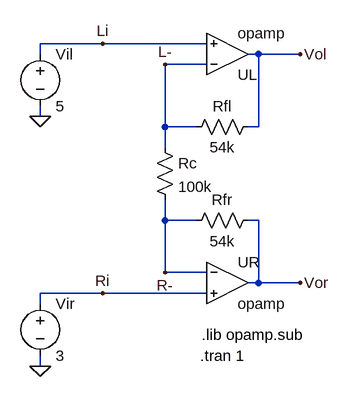
[diagram p0: schematic TDA8425_spatial.asc]
TDA8425_spatial.asc, the LTspice schematic file:
Version 4
SHEET 1 880 680
WIRE 0 0 -96 0
WIRE 160 0 0 0
WIRE -96 16 -96 0
WIRE 240 16 224 16
WIRE 304 16 240 16
WIRE 160 32 96 32
WIRE -96 112 -96 96
WIRE 96 128 96 32
WIRE 144 128 96 128
WIRE 240 128 240 16
WIRE 240 128 224 128
WIRE 96 160 96 128
WIRE 96 272 96 240
WIRE 144 272 96 272
WIRE 240 272 224 272
WIRE 96 352 96 272
WIRE 160 352 96 352
WIRE 240 368 240 272
WIRE 240 368 224 368
WIRE 304 368 240 368
WIRE 0 384 -96 384
WIRE 160 384 0 384
WIRE -96 400 -96 384
WIRE -96 496 -96 480
FLAG -96 112 0
FLAG -96 496 0
FLAG 304 16 Vol
FLAG 304 368 Vor
FLAG 0 0 Li
FLAG 96 32 L-
FLAG 96 352 R-
FLAG 0 384 Ri
SYMBOL Opamps\\opamp 192 80 M180
SYMATTR InstName UL
SYMBOL res 240 112 R90
WINDOW 0 0 56 VBottom 2
WINDOW 3 32 56 VTop 2
SYMATTR InstName Rfl
SYMATTR Value 54k
SYMBOL res 240 256 R90
WINDOW 0 0 56 VBottom 2
WINDOW 3 32 56 VTop 2
SYMATTR InstName Rfr
SYMATTR Value 54k
SYMBOL res 80 144 R0
SYMATTR InstName Rc
SYMATTR Value 100k
SYMBOL voltage -96 0 R0
WINDOW 123 24 124 Left 2
WINDOW 39 24 124 Left 2
SYMATTR InstName Vil
SYMATTR Value 5
SYMBOL Opamps\\opamp 192 304 R0
SYMATTR InstName UR
SYMBOL voltage -96 384 R0
WINDOW 123 24 124 Left 2
WINDOW 39 24 124 Left 2
SYMATTR InstName Vir
SYMATTR Value 3
TEXT 150 480 Left 2 !.tran 1
TEXT 152 448 Left 2 !.lib opamp.sub

The netlist it stands for:
* TDA8425_spatial.asc
XUL L- Li Vol opamp Aol=100K GBW=10Meg  ; pins invin noninvin out
Rfl Vol L- 54k
Rfr Vor R- 54k
Rc L- R- 100k
Vil Li 0 5
XUR R- Ri Vor opamp Aol=100K GBW=10Meg  ; pins invin noninvin out
Vir Ri 0 3
.tran 1
.lib opamp.sub
.backanno
.end